# Altium schematic sheet CH32V00x_Touch_Kit.SchDoc
size A4
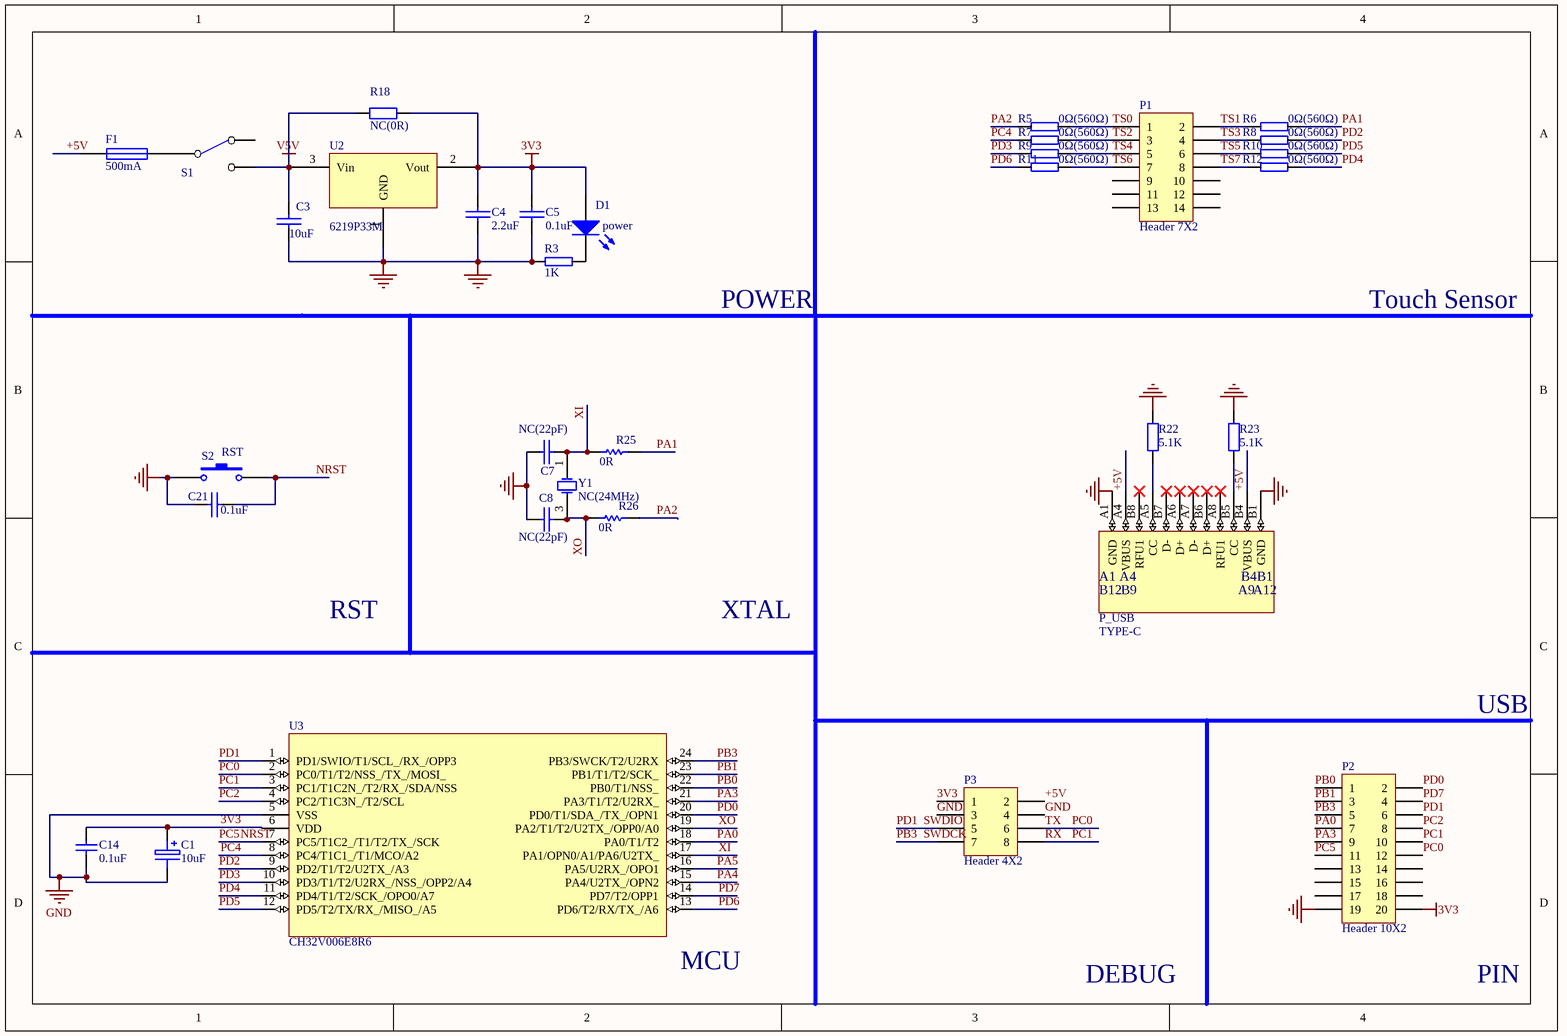
[diagram p0: CH32V00x_Touch_Kit.SchDoc]

## Parts
C1  10uF  [CASE-A_3216]
C3  10uF  [0603_C]
C4  2.2uF  [0402_C]
C5  0.1uF  [0402_C]
C7  NC(22pF)  [0402_C]
C8  NC(22pF)  [0402_C]
C14  0.1uF  [0402_C]
C21  0.1uF  [0402_C]
D1  power  [0603+]
F1  500mA  [0603]
P1  Header 7X2  [HDR-TH_14P-P2.54-H-M-R2-C10-S2.54]
P2  Header 10X2  [HDR-TH_20P-P2.54-H-M-R2-C10-S2.54]
P3  Header 4X2  [IDC8-2.54mm]
P_USB  TYPE-C  [TYPE-C-Receptacle-2.0]
R3  1K  [0402]
R5  0Ω(560Ω)  [0402]
R6  0Ω(560Ω)  [0402]
R7  0Ω(560Ω)  [0402]
R8  0Ω(560Ω)  [0402]
R9  0Ω(560Ω)  [0402]
R10  0Ω(560Ω)  [0402]
R11  0Ω(560Ω)  [0402]
R12  0Ω(560Ω)  [0402]
R18  NC(0R)  [0402]
R22  5.1K  [0402]
R23  5.1K  [0402]
R25  0R  [0402]
R26  0R  [0402]
S1  SW SPDT  [SW1]  (value not drawn)
S2  RST  [SMD_6.1x3.65x2.5mm-KEY]
U2  6219P33M  [SOT-23]
U3  CH32V006E8R6  [QSOP24]
Y1  NC(24MHz)  [XT3225]

## Nets
3V3: C1.1 C4.1 C5.1 C14.2 D1.1(A) P2.20 P3.1 R18.1 U2.2(Vout) U3.6(VDD)
GND: C1.2 C3.2 C4.2 C5.2 C7.1 C8.1 C14.1 C21.1 P2.19 P3.3 P3.4 P_USB.A1(GND) P_USB.B1(GND) R3.2 R22.2 R23.2 S2.1 U2.1(GND) U3.5(VSS)
V5V: C3.1 R18.2 S1.2(NC) U2.3(Vin)
+5V: F1.1 P3.2 P_USB.A4(VBUS) P_USB.B4(VBUS)
NRST: C21.2 P2.11 S2.2 U3.7(PC5/T1C2_/T1/T2/TX_/SCK)  [also labelled PC5]
PA0: P2.7 U3.18(PA0/T1/T2)
PA1: R6.2 R25.2
PA2: R5.1 R26.2
PA3: P2.9 U3.21(PA3/T1/T2/U2RX_)
PA4: U3.15(PA4/U2TX_/OPN2)
PA5: U3.16(PA5/U2RX_/OPO1)
PB0: P2.1 U3.22(PB0/T1/NSS_)
PB1: P2.3 U3.23(PB1/T1/T2/SCK_)
PB3: P2.5 P3.7 U3.24(PB3/SWCK/T2/U2RX)  [also labelled SWDCK]
PC0: P2.12 P3.6 U3.2(PC0/T1/T2/NSS_/TX_/MOSI_)  [also labelled TX]
PC1: P2.10 P3.8 U3.3(PC1/T1C2N_/T2/RX_/SDA/NSS)  [also labelled RX]
PC2: P2.8 U3.4(PC2/T1C3N_/T2/SCL)
PC4: R7.1 U3.8(PC4/T1C1_/T1/MCO/A2)
PD0: P2.2 U3.20(PD0/T1/SDA_/TX_/OPN1)
PD1: P2.6 P3.5 U3.1(PD1/SWIO/T1/SCL_/RX_/OPP3)  [also labelled SWDIO]
PD2: R8.2 U3.9(PD2/T1/T2/U2TX_/A3)
PD3: R9.1 U3.10(PD3/T1/T2/U2RX_/NSS_/OPP2/A4)
PD4: R12.2 U3.11(PD4/T1/T2/SCK_/OPO0/A7)
PD5: R10.2 U3.12(PD5/T2/TX/RX_/MISO_/A5)
PD6: R11.1 U3.13(PD6/T2/RX/TX_/A6)
PD7: P2.4 U3.14(PD7/T2/OPP1)
TS0: P1.1 R5.2
TS1: P1.2 R6.1
TS2: P1.3 R7.2
TS3: P1.4 R8.1
TS4: P1.5 R9.2
TS5: P1.6 R10.1
TS6: P1.7 R11.2
TS7: P1.8 R12.1
XI: C7.2 R25.1 U3.17(PA1/OPN0/A1/PA6/U2TX_) Y1.1(OSC1)
XO: C8.2 R26.1 U3.19(PA2/T1/T2/U2TX_/OPP0/A0) Y1.3(OSC2)
NetD1_2: D1.2(K) R3.1
NetF1_2: F1.2 S1.1(COMMON)
NetP_USB_A5: P_USB.A5(CC) R22.1
NetP_USB_B5: P_USB.B5(CC) R23.1

Not connected (* = marked no-connect by the designer): P1 9 10 11 12 13 14; P2 13 14 15 16 17 18; P_USB A6(D+)* A7(D-)* A8(RFU1)* B6(D+)* B7(D-)* B8(RFU1)*; S1 3(NO)

## Notes on the sheet
- POWER
- Touch Sensor
- RST
- XTAL
- USB
- (near U3) MCU
- DEBUG
- PIN
- (in symbol TYPE-C1) B12; B9; A9; A12

## Library data of the parts
C1 = T-A/4.7uF/16V
C3-C5 C7 C8 C21 = CAP: Capacitor
C14 = Cap: Capacitor; Value: 15pF; Published: 8-Jun-2000; LatestRevisionDate: 17-Jul-2002; LatestRevisionNote: Re-released for DXP Platform.; PackageReference: RAD-0.3; Publisher: Altium Limited
D1 = LED0: Typical INFRARED GaAs LED; Published: 8-Jun-2000; LatestRevisionDate: 08-Jul-2005; LatestRevisionNote: Mech Layer 1 removed.; PackageReference: LED-0; Publisher: Altium Limited; PackageDescription: LED; 2 Leads
F1 = FUSE1: Fuse
P1 = Header 7X2: Header, 7-Pin, Dual row; LatestRevisionDate: 17-Jul-2002; LatestRevisionNote: Re-released for DXP Platform.; Publisher: Altium Limited
P2 = Header 10X2: Header, 10-Pin, Dual row; LatestRevisionDate: 17-Jul-2002; LatestRevisionNote: Re-released for DXP Platform.; Publisher: Altium Limited
P3 = Header 4X2: Header, 4-Pin, Dual row; LatestRevisionDate: 17-Jul-2002; LatestRevisionNote: Re-released for DXP Platform.; Publisher: Altium Limited
P_USB = TYPE-C1
R3 R5-R12 = RES
R18 R22 R23 = Res2: Resistor
  R18: Published: 8-Jun-2000; LatestRevisionDate: 17-Jul-2002; LatestRevisionNote: Re-released for DXP Platform.; PackageReference: AXIAL-0.4; Publisher: Altium Limited
R25 R26 = Res Semi: Semiconductor Resistor; Published: 8-Jun-2000; LatestRevisionDate: 17-Jul-2002; LatestRevisionNote: Re-released for DXP Platform.; PackageReference: AXIAL-0.5; Publisher: Altium Limited; Value: 0R
S2 = SW-PB: Switch; Published: 24-Mar-1999; LatestRevisionDate: 17-Jul-2002; LatestRevisionNote: Re-released for DXP Platform.; PackageReference: SPST-2; Publisher: Altium Limited; PackageDescription: Switch; 2 Leads
U3 = CH32V006E8R6: RISC-V MCU, 48MHz, ADC/OPA/CMP/2*UART/I2C/SPI
Y1 = XTAL: Crystal Oscillator; Published: 8-Jun-2000; LatestRevisionDate: 17-Jul-2002; LatestRevisionNote: Re-released for DXP Platform.; PackageReference: R38; Publisher: Altium Limited; PackageDescription: Crystal, Thru-Hole; 2 Leads; Body 3.1 x 8.2 mm (Dia.xH)